# Altium schematic sheet RWR.SchDoc
size A; SheetNumber: 3; SheetTotal: 3
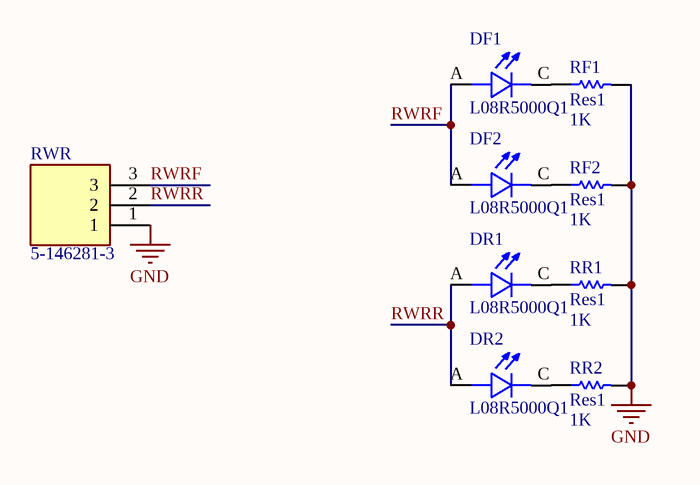
[diagram p0: RWR.SchDoc]

## Parts
DF1  L08R5000Q1  [LEDRD254W57D500H1070]
DF2  L08R5000Q1  [LEDRD254W57D500H1070]
DR1  L08R5000Q1  [LEDRD254W57D500H1070]
DR2  L08R5000Q1  [LEDRD254W57D500H1070]
RF1  Res1  value 1K  [AXIAL-0.3]
RF2  Res1  value 1K  [AXIAL-0.3]
RR1  Res1  value 1K  [AXIAL-0.3]
RR2  Res1  value 1K  [AXIAL-0.3]
RWR  5-146281-3  [TE_5-146281-3]

## Nets
GND: RF1.2 RF2.2 RR1.2 RR2.2 RWR.1
RWRF: DF1.A DF2.A RWR.3
RWRR: DR1.A DR2.A RWR.2
NetDF1_C: DF1.C RF1.1
NetDF2_C: DF2.C RF2.1
NetDR1_C: DR1.C RR1.1
NetDR2_C: DR2.C RR2.1

## Library data of the parts
DF1 DF2 DR1 DR2 = L08R5000Q1: LED, Orange, Through Hole, T-1 3/4 (5mm), 30 mA, 2.1 V, 635 nm; Price: None; MP: L08R5000Q1; Value: *; Availability: Unavailable; Package: None
RF1 RF2 RR1 RR2 = Res1: Resistor; Published: 8-Jun-2000; LatestRevisionDate: 17-Jul-2002; LatestRevisionNote: Re-released for DXP Platform.; PackageReference: AXIAL-0.3; Publisher: Altium Limited; PackageDescription: Axial Device, Thru-Hole; 2 Leads; 0.3 in Pin Spacing
RWR = 5-146281-3: Header; Conn; Interconnect System; PCB Plug; 3 Cont; Thru-Hole; Breakaway; Straight; 3A; Centerline_Pitch: 2.54 mm[.1 in]; Number_of_Positions: 3; MF: TE Connectivity; Product_Type: Connector; TE_purchase_URL: https://www.te.com/usa-en/product-5-146281-3.html?te_bu=Cor&te_type=disp&te_campaign=seda_glo_cor-seda-global-disp-prtnr-fy19-seda-model-bom-cta_sma-317_1&elqCampaignId=32493; SnapEDA_Link: https://www.snapeda.com/parts/5-146281-3/TE%20Connectivity%20AMP%20Connectors/view-part/460785/?ref=snap; Availability: Unavailable; EU_RoHS_Compliance: Compliant; MP: 5-146281-3; Value: *; Price: None; Package: None